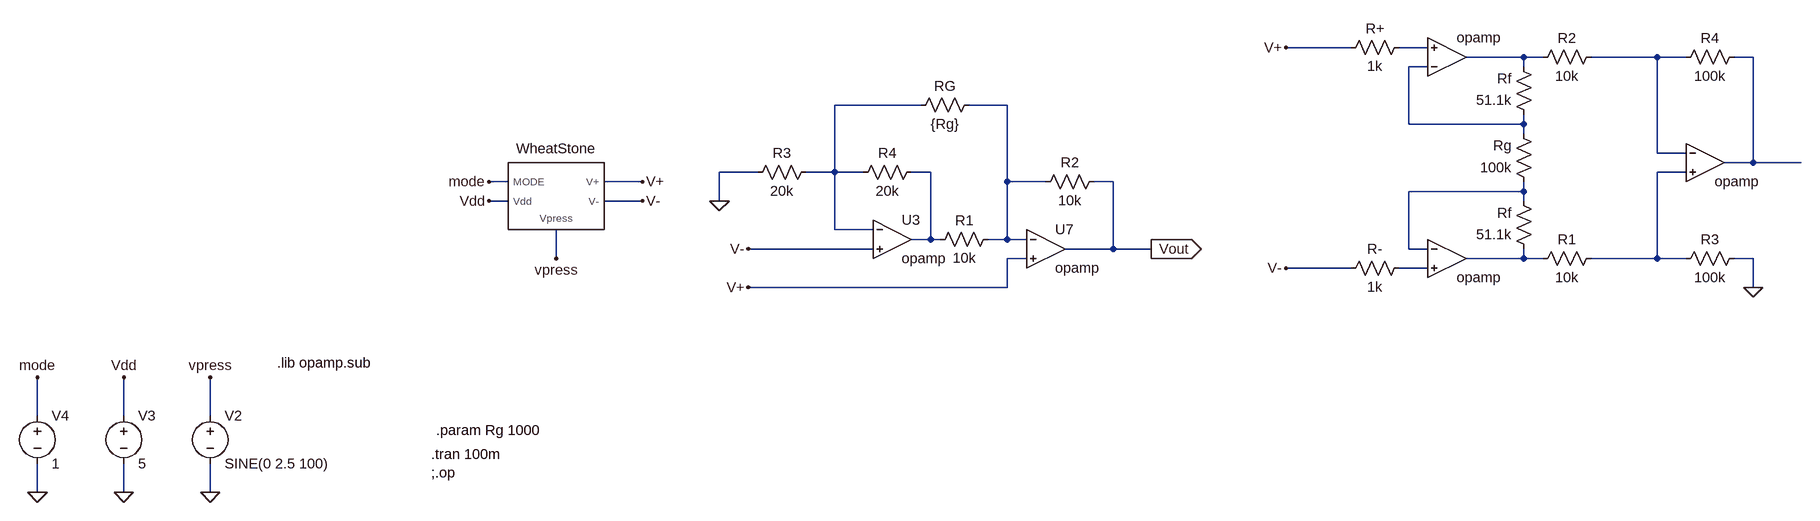
[diagram p0: schematic PZR_INA.asc]
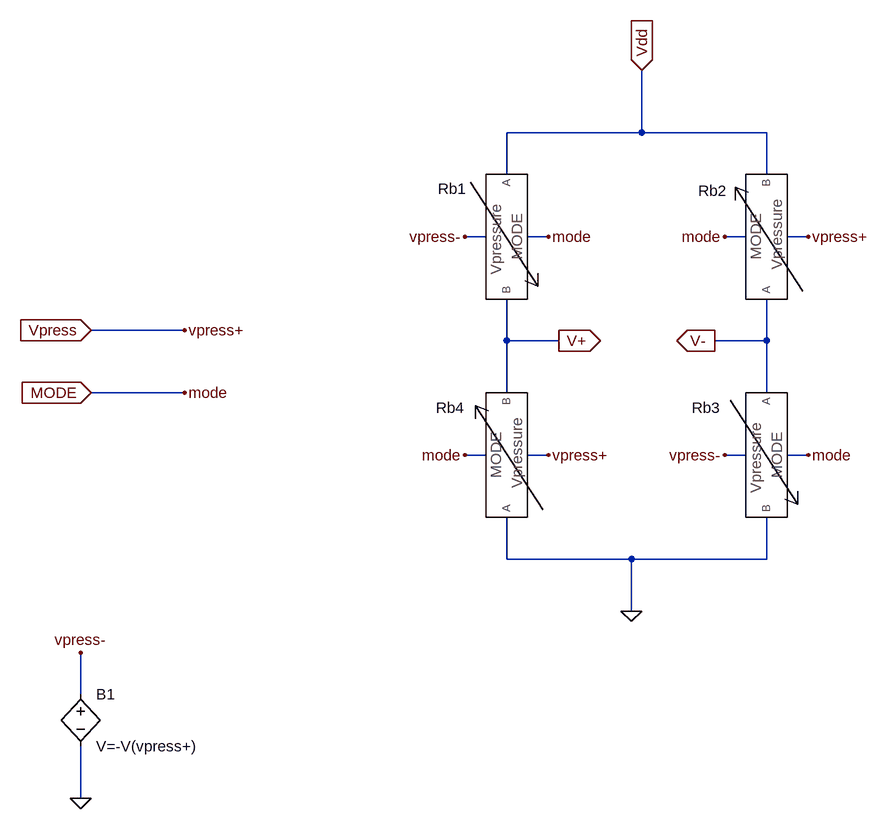
[diagram p1: sub-circuit com_wheatstone.asc]
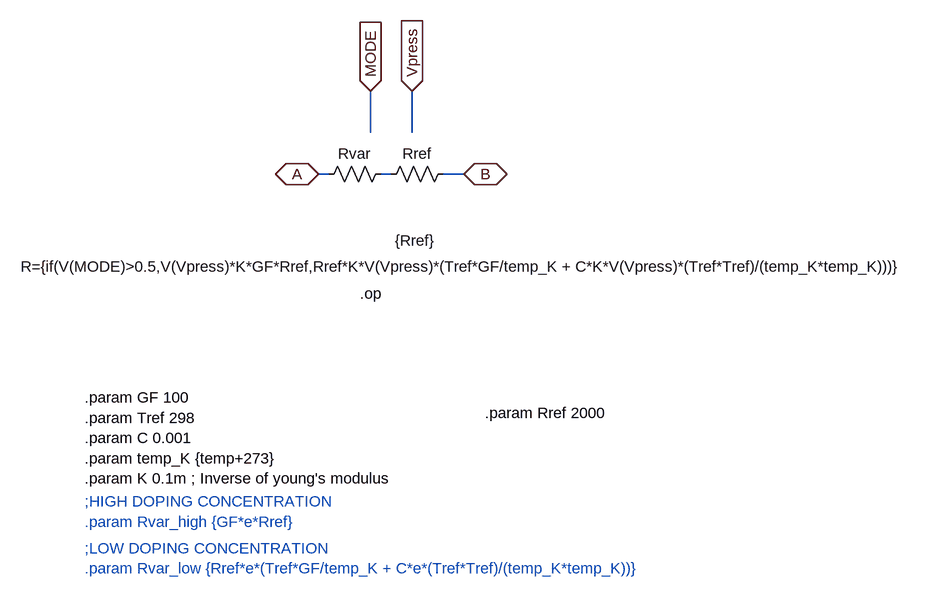
[diagram p2: sub-circuit sensor_res.asc]
PZR_INA.asc, the LTspice schematic file:
Version 4
SHEET 1 3044 1064
WIRE 2288 -48 2176 -48
WIRE 2416 -48 2368 -48
WIRE 2576 -32 2480 -32
WIRE 2608 -32 2576 -32
WIRE 2800 -32 2688 -32
WIRE 2848 -32 2800 -32
WIRE 2960 -32 2928 -32
WIRE 2416 -16 2384 -16
WIRE 2576 -16 2576 -32
WIRE 1328 48 1184 48
WIRE 1472 48 1408 48
WIRE 2384 80 2384 -16
WIRE 2576 80 2576 64
WIRE 2576 80 2384 80
WIRE 2576 96 2576 80
WIRE 2800 128 2800 -32
WIRE 2848 128 2800 128
WIRE 2960 144 2960 -32
WIRE 2960 144 2912 144
WIRE 3040 144 2960 144
WIRE 1056 160 992 160
WIRE 1184 160 1184 48
WIRE 1184 160 1136 160
WIRE 1232 160 1184 160
WIRE 1344 160 1312 160
WIRE 2848 160 2800 160
WIRE 640 176 608 176
WIRE 864 176 800 176
WIRE 1472 176 1472 48
WIRE 1536 176 1472 176
WIRE 1648 176 1616 176
WIRE 2576 192 2576 176
WIRE 2576 192 2384 192
WIRE 640 208 608 208
WIRE 864 208 800 208
WIRE 992 208 992 160
WIRE 2576 208 2576 192
WIRE 1184 256 1184 160
WIRE 1248 256 1184 256
WIRE 1344 272 1344 160
WIRE 1344 272 1312 272
WIRE 1360 272 1344 272
WIRE 1472 272 1472 176
WIRE 1472 272 1440 272
WIRE 1504 272 1472 272
WIRE 1248 288 1040 288
WIRE 1648 288 1648 176
WIRE 1648 288 1568 288
WIRE 1712 288 1648 288
WIRE 2384 288 2384 192
WIRE 2416 288 2384 288
WIRE 720 304 720 256
WIRE 1504 304 1472 304
WIRE 2576 304 2576 288
WIRE 2576 304 2480 304
WIRE 2608 304 2576 304
WIRE 2800 304 2800 160
WIRE 2800 304 2688 304
WIRE 2848 304 2800 304
WIRE 2960 304 2928 304
WIRE 2288 320 2176 320
WIRE 2416 320 2368 320
WIRE 1472 352 1472 304
WIRE 1472 352 1040 352
WIRE 2960 352 2960 304
WIRE -208 768 -208 704
WIRE -64 768 -64 704
WIRE 80 768 80 704
WIRE -208 896 -208 848
WIRE -64 896 -64 848
WIRE 80 896 80 848
FLAG 80 896 0
FLAG -64 896 0
FLAG -208 896 0
FLAG -64 704 Vdd
FLAG -208 704 mode
FLAG 608 208 Vdd
FLAG 608 176 mode
FLAG 80 704 vpress
FLAG 720 304 vpress
FLAG 864 176 V+
FLAG 864 208 V-
FLAG 2960 352 0
FLAG 2176 -48 V+
FLAG 2176 320 V-
FLAG 992 208 0
FLAG 1040 352 V+
FLAG 1040 288 V-
FLAG 1712 288 Vout
IOPIN 1712 288 Out
SYMBOL COM_WHEATSTONE 720 192 R0
SYMATTR InstName WheatStone
SYMBOL voltage 80 752 R0
SYMATTR InstName V2
SYMATTR Value SINE(0 2.5 100)
SYMATTR Value2 AC 10
SYMBOL voltage -64 752 R0
SYMATTR InstName V3
SYMATTR Value 5
SYMATTR Value2 AC 10
SYMBOL voltage -208 752 R0
SYMATTR InstName V4
SYMATTR Value 1
SYMATTR Value2 AC 10
SYMBOL Opamps/opamp 2448 32 M180
WINDOW 0 0 32 Invisible 2
SYMATTR InstName U4
SYMBOL Opamps/opamp 2448 240 R0
WINDOW 0 0 32 Invisible 2
SYMATTR InstName U5
SYMBOL Opamps/opamp 2880 80 R0
WINDOW 0 0 32 Invisible 2
SYMATTR InstName U6
SYMBOL res 2592 304 R180
WINDOW 0 36 76 Left 2
WINDOW 3 36 40 Left 2
SYMATTR InstName Rf
SYMATTR Value 51.1k
SYMBOL res 2592 80 R180
WINDOW 0 36 76 Left 2
WINDOW 3 36 40 Left 2
SYMATTR InstName Rf
SYMATTR Value 51.1k
SYMBOL res 2592 192 R180
WINDOW 0 36 76 Left 2
WINDOW 3 36 40 Left 2
SYMATTR InstName Rg
SYMATTR Value 100k
SYMBOL res 2592 -16 R270
WINDOW 0 32 56 VTop 2
WINDOW 3 0 56 VBottom 2
SYMATTR InstName R2
SYMATTR Value 10k
SYMBOL res 2592 320 R270
WINDOW 0 32 56 VTop 2
WINDOW 3 0 56 VBottom 2
SYMATTR InstName R1
SYMATTR Value 10k
SYMBOL res 2832 320 R270
WINDOW 0 32 56 VTop 2
WINDOW 3 0 56 VBottom 2
SYMATTR InstName R3
SYMATTR Value 100k
SYMBOL res 2832 -16 R270
WINDOW 0 32 56 VTop 2
WINDOW 3 0 56 VBottom 2
SYMATTR InstName R4
SYMATTR Value 100k
SYMBOL res 2272 -32 R270
WINDOW 0 32 56 VTop 2
WINDOW 3 0 56 VBottom 2
SYMATTR InstName R+
SYMATTR Value 1k
SYMBOL res 2272 336 R270
WINDOW 0 32 56 VTop 2
WINDOW 3 0 56 VBottom 2
SYMATTR InstName R-
SYMATTR Value 1k
SYMBOL Opamps/opamp 1280 208 R0
SYMATTR InstName U3
SYMBOL Opamps/opamp 1536 224 R0
SYMATTR InstName U7
SYMBOL res 1344 288 R270
WINDOW 0 32 56 VTop 2
WINDOW 3 0 56 VBottom 2
SYMATTR InstName R1
SYMATTR Value 10k
SYMBOL res 1216 176 R270
WINDOW 0 32 56 VTop 2
WINDOW 3 0 56 VBottom 2
SYMATTR InstName R4
SYMATTR Value 20k
SYMBOL res 1312 64 R270
WINDOW 0 32 56 VTop 2
WINDOW 3 0 56 VBottom 2
SYMATTR InstName RG
SYMATTR Value {Rg}
SYMBOL res 1632 160 R90
WINDOW 0 0 56 VBottom 2
WINDOW 3 32 56 VTop 2
SYMATTR InstName R2
SYMATTR Value 10k
SYMBOL res 1152 144 R90
WINDOW 0 0 56 VBottom 2
WINDOW 3 32 56 VTop 2
SYMATTR InstName R3
SYMATTR Value 20k
TEXT 192 680 Left 2 !.lib opamp.sub
TEXT 512 832 Left 2 !.tran 100m\n;.op
TEXT 520 792 Left 2 !.param Rg 1000

com_wheatstone.asc, the sub-circuit schematic file:
Version 4
SHEET 1 1064 1200
WIRE 448 112 448 16
WIRE 448 112 240 112
WIRE 640 112 448 112
WIRE 240 176 240 112
WIRE 640 176 640 112
WIRE 208 272 176 272
WIRE 304 272 272 272
WIRE 608 272 576 272
WIRE 704 272 672 272
WIRE -256 416 -400 416
WIRE 240 432 240 368
WIRE 320 432 240 432
WIRE 640 432 640 368
WIRE 640 432 560 432
WIRE -256 512 -400 512
WIRE 240 512 240 432
WIRE 640 512 640 432
WIRE 208 608 176 608
WIRE 304 608 272 608
WIRE 608 608 576 608
WIRE 704 608 672 608
WIRE 240 768 240 704
WIRE 432 768 240 768
WIRE 640 768 640 704
WIRE 640 768 432 768
WIRE 432 848 432 768
WIRE -416 976 -416 912
WIRE -416 1136 -416 1056
FLAG 432 848 0
FLAG 176 608 mode
FLAG 304 272 mode
FLAG 704 608 mode
FLAG 576 272 mode
FLAG 304 608 vpress+
FLAG 704 272 vpress+
FLAG 576 608 vpress-
FLAG 176 272 vpress-
FLAG 448 16 Vdd
IOPIN 448 16 In
FLAG 320 432 V+
IOPIN 320 432 Out
FLAG 560 432 V-
IOPIN 560 432 Out
FLAG -416 1136 0
FLAG -416 912 vpress-
FLAG -400 416 Vpress
IOPIN -400 416 In
FLAG -256 416 vpress+
FLAG -400 512 MODE
IOPIN -400 512 In
FLAG -256 512 mode
SYMBOL SENSOR_RES 224 608 R270
WINDOW 0 57 -71 VTop 2
SYMATTR InstName Rb4
SYMBOL SENSOR_RES 656 608 R90
WINDOW 0 -88 109 VTop 2
SYMATTR InstName Rb3
SYMBOL SENSOR_RES 256 272 R90
WINDOW 0 -89 100 VTop 2
SYMATTR InstName Rb1
SYMBOL SENSOR_RES 624 272 R270
WINDOW 0 55 -67 VTop 2
SYMATTR InstName Rb2
SYMBOL bv -416 960 R0
SYMATTR InstName B1
SYMATTR Value V=-V(vpress+)

sensor_res.asc, the sub-circuit schematic file:
Version 4
SHEET 1 1248 1508
WIRE 400 272 400 208
WIRE 464 272 464 208
WIRE 336 336 320 336
WIRE 432 336 416 336
WIRE 544 336 512 336
FLAG 464 208 Vpress
IOPIN 464 208 In
FLAG 400 208 MODE
IOPIN 400 208 In
FLAG 320 336 A
IOPIN 320 336 BiDir
FLAG 544 336 B
IOPIN 544 336 BiDir
SYMBOL res 432 320 R90
WINDOW 0 0 56 VBottom 2
WINDOW 3 143 -113 VTop 2
SYMATTR InstName Rvar
SYMATTR Value R={if(V(MODE)>0.5,V(Vpress)*K*GF*Rref,Rref*K*V(Vpress)*(Tref*GF/temp_K + C*K*V(Vpress)*(Tref*Tref)/(temp_K*temp_K)))}
SYMBOL res 528 320 R90
WINDOW 0 0 56 VBottom 2
WINDOW 3 103 59 VTop 2
SYMATTR InstName Rref
SYMATTR Value {Rref}
TEXT -40 680 Left 2 !.param GF 100\n.param Tref 298\n.param C 0.001\n.param temp_K {temp+273}\n.param K 0.1m ; Inverse of young's modulus
TEXT -40 912 Left 2 ;;LOW DOPING CONCENTRATION\n.param Rvar_low {Rref*e*(Tref*GF/temp_K + C*e*(Tref*Tref)/(temp_K*temp_K))}
TEXT -40 840 Left 2 ;;HIGH DOPING CONCENTRATION\n.param Rvar_high {GF*e*Rref}
TEXT 576 704 Left 2 !.param Rref 2000
TEXT 384 520 Left 2 !.op

The netlist it stands for:
* PZR_INA.asc
XWheatStone mode Vdd vpress V+ V- com_wheatstone
V2 vpress 0 SINE(0 2.5 100) AC 10
V3 Vdd 0 5 AC 10
V4 mode 0 1 AC 10
XU4 N005 N001 N002 opamp Aol=100K GBW=10Meg  ; pins invin noninvin out
XU5 N010 N012 N011 opamp Aol=100K GBW=10Meg  ; pins invin noninvin out
XU6 N003 N009 N004 opamp Aol=100K GBW=10Meg  ; pins invin noninvin out
Rf N011 N010 51.1k
Rf N005 N002 51.1k
Rg N010 N005 100k
R2 N002 N003 10k
R1 N011 N009 10k
R3 N009 0 100k
R4 N003 N004 100k
R+ V+ N001 1k
R- V- N012 1k
XU3 N006 V- N008 opamp Aol=100K GBW=10Meg  ; pins invin noninvin out
XU7 N007 V+ Vout opamp Aol=100K GBW=10Meg  ; pins invin noninvin out
R1 N008 N007 10k
R4 N006 N008 20k
RG N006 N007 {Rg}
R2 Vout N007 10k
R3 N006 0 20k

* block symbol definitions
.subckt com_wheatstone MODE Vdd Vpress V+ V-
XRb4 mode Vpress 0 V+ sensor_res
XRb3 mode vpress- V- 0 sensor_res
XRb1 mode vpress- Vdd V+ sensor_res
XRb2 mode Vpress V- Vdd sensor_res
B1 vpress- 0 V=-V(vpress+)
.ends com_wheatstone

.subckt sensor_res MODE Vpress A B
Rvar N001 A R={if(V(MODE)>0.5,V(Vpress)*K*GF*Rref,Rref*K*V(Vpress)*(Tref*GF/temp_K + C*K*V(Vpress)*(Tref*Tref)/(temp_K*temp_K)))}
Rref B N001 {Rref}
.param GF 100
.param Tref 298
.param C 0.001
.param temp_K {temp+273}
.param K 0.1m ; Inverse of young's modulus
* ;LOW DOPING CONCENTRATION
* .param Rvar_low {Rref*e*(Tref*GF/temp_K + C*e*(Tref*Tref)/(temp_K*temp_K))}
* ;HIGH DOPING CONCENTRATION
* .param Rvar_high {GF*e*Rref}
.param Rref 2000
.op
.ends sensor_res

.lib opamp.sub
.tran 100m
;.op
.param Rg 1000
.backanno
.end